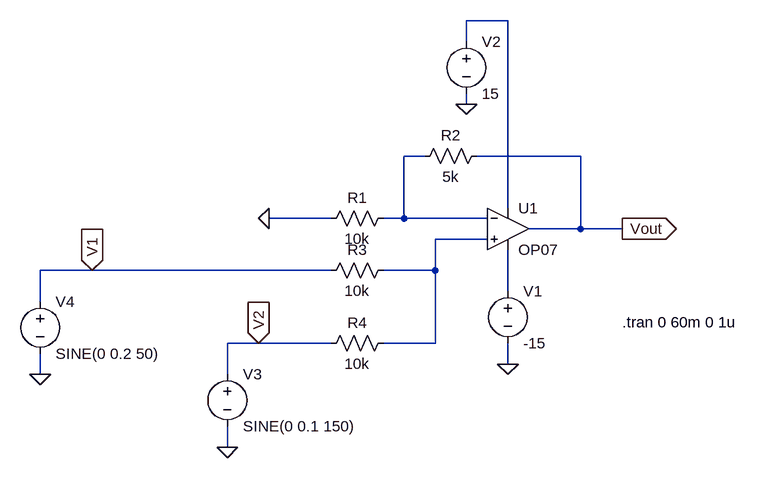
[diagram p0: schematic 006-non-Inverting-Summing-Amplifier.asc]
006-non-Inverting-Summing-Amplifier.asc, the LTspice schematic file:
Version 4
SHEET 1 880 680
WIRE 320 -256 256 -256
WIRE 256 -224 256 -256
WIRE 256 -128 256 -144
WIRE 192 -48 160 -48
WIRE 432 -48 272 -48
WIRE 320 32 320 -256
WIRE 48 48 -48 48
WIRE 160 48 160 -48
WIRE 160 48 128 48
WIRE 288 48 160 48
WIRE 432 64 432 -48
WIRE 432 64 352 64
WIRE 496 64 432 64
WIRE 288 80 208 80
WIRE -320 128 -400 128
WIRE 48 128 -320 128
WIRE 208 128 208 80
WIRE 208 128 128 128
WIRE 320 160 320 96
WIRE -400 176 -400 128
WIRE -64 240 -112 240
WIRE 48 240 -64 240
WIRE 208 240 208 128
WIRE 208 240 128 240
WIRE 320 272 320 240
WIRE -400 288 -400 256
WIRE -112 288 -112 240
WIRE -112 400 -112 368
FLAG 320 272 0
FLAG 256 -128 0
FLAG 496 64 Vout
IOPIN 496 64 Out
FLAG -320 128 V1
IOPIN -320 128 In
FLAG -400 288 0
FLAG -48 48 0
FLAG -64 240 V2
IOPIN -64 240 In
FLAG -112 400 0
SYMBOL voltage 320 144 R0
SYMATTR InstName V1
SYMATTR Value -15
SYMBOL voltage 256 -240 R0
SYMATTR InstName V2
SYMATTR Value 15
SYMBOL res 144 32 R90
WINDOW 0 0 56 VBottom 2
WINDOW 3 32 56 VTop 2
SYMATTR InstName R1
SYMATTR Value 10k
SYMBOL res 288 -64 R90
WINDOW 0 0 56 VBottom 2
WINDOW 3 32 56 VTop 2
SYMATTR InstName R2
SYMATTR Value 5k
SYMBOL res 144 112 R90
WINDOW 0 0 56 VBottom 2
WINDOW 3 32 56 VTop 2
SYMATTR InstName R3
SYMATTR Value 10k
SYMBOL res 32 256 R270
WINDOW 0 32 56 VTop 2
WINDOW 3 0 56 VBottom 2
SYMATTR InstName R4
SYMATTR Value 10k
SYMBOL Opamps\\OP07 320 0 R0
SYMATTR InstName U1
SYMBOL voltage -400 160 R0
WINDOW 123 0 0 Left 2
WINDOW 39 0 0 Left 2
SYMATTR InstName V4
SYMATTR Value SINE(0 0.2 50)
SYMBOL voltage -112 272 R0
WINDOW 123 0 0 Left 2
WINDOW 39 0 0 Left 2
SYMATTR InstName V3
SYMATTR Value SINE(0 0.1 150)
TEXT 496 208 Left 2 !.tran 0 60m 0 1u

The netlist it stands for:
* 006-non-Inverting-Summing-Amplifier.asc
V1 N004 0 -15
V2 N001 0 15
R1 N002 0 10k
R2 Vout N002 5k
R3 N003 V1 10k
R4 V2 N003 10k
XU1 N003 N002 N001 N004 Vout LT1001  ; OP07, pins In+ In- V+ V- OUT
V4 V1 0 SINE(0 0.2 50)
V3 V2 0 SINE(0 0.1 150)
.tran 0 60m 0 1u
.lib LTC.lib
.backanno
.end